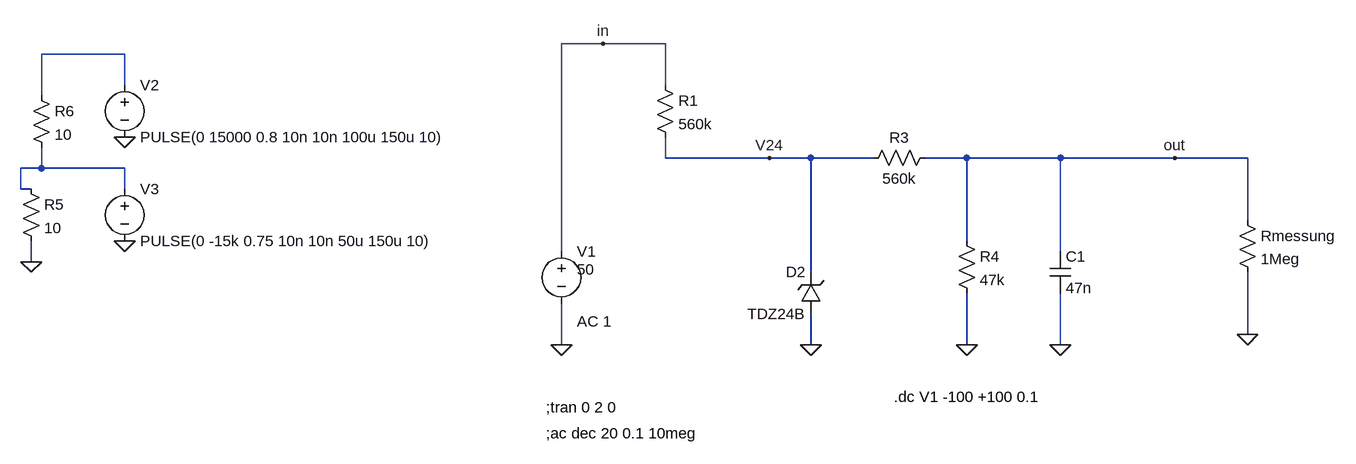
[diagram p0: schematic AnalogEingang.asc]
AnalogEingang.asc, the LTspice schematic file:
Version 4
SHEET 1 1468 680
WIRE -208 -160 -272 -160
WIRE -112 -160 -208 -160
WIRE -944 -144 -1072 -144
WIRE -944 -96 -944 -144
WIRE -112 -96 -112 -160
WIRE -1072 -80 -1072 -144
WIRE -112 16 -112 -16
WIRE 48 16 -112 16
WIRE 112 16 48 16
WIRE 208 16 112 16
WIRE 352 16 288 16
WIRE 496 16 352 16
WIRE 672 16 496 16
WIRE 784 16 672 16
WIRE -1072 32 -1072 0
WIRE -1072 32 -1104 32
WIRE -944 32 -1072 32
WIRE -1104 64 -1104 32
WIRE -1088 64 -1104 64
WIRE -944 64 -944 32
WIRE 784 112 784 16
WIRE 352 144 352 16
WIRE -272 160 -272 -160
WIRE 496 160 496 16
WIRE -1088 176 -1088 144
WIRE 112 192 112 16
WIRE 784 288 784 192
WIRE -272 304 -272 240
WIRE 112 304 112 256
WIRE 352 304 352 224
WIRE 496 304 496 224
FLAG 112 304 0
FLAG -272 304 0
FLAG 672 16 out
FLAG -208 -160 in
FLAG 784 288 0
FLAG 352 304 0
FLAG 496 304 0
FLAG -944 144 0
FLAG -944 -16 0
FLAG -1088 176 0
FLAG 48 16 V24
SYMBOL zener 128 256 R180
WINDOW 0 24 64 Left 2
WINDOW 3 24 0 Left 2
SYMATTR InstName D2
SYMATTR Value TDZ24B
SYMBOL voltage -272 144 R0
WINDOW 123 24 124 Left 2
WINDOW 39 0 0 Left 0
WINDOW 3 24 44 Left 2
SYMATTR Value2 AC 1
SYMATTR Value 50
SYMATTR InstName V1
SYMBOL res -128 -112 R0
SYMATTR InstName R1
SYMATTR Value 560k
SYMBOL res 768 96 R0
SYMATTR InstName Rmessung
SYMATTR Value 1Meg
SYMBOL res 304 0 R90
WINDOW 0 0 56 VBottom 2
WINDOW 3 32 56 VTop 2
SYMATTR InstName R3
SYMATTR Value 560k
SYMBOL res 336 128 R0
SYMATTR InstName R4
SYMATTR Value 47k
SYMBOL voltage -944 -112 R0
WINDOW 123 0 0 Left 0
WINDOW 39 0 0 Left 0
SYMATTR InstName V2
SYMATTR Value PULSE(0 15000 0.8 10n 10n 100u 150u 10)
SYMBOL cap 480 160 R0
SYMATTR InstName C1
SYMATTR Value 47n
SYMBOL voltage -944 48 R0
WINDOW 123 0 0 Left 0
WINDOW 39 0 0 Left 0
SYMATTR InstName V3
SYMATTR Value PULSE(0 -15k 0.75 10n 10n 50u 150u 10)
SYMBOL res -1104 48 R0
SYMATTR InstName R5
SYMATTR Value 10
SYMBOL res -1088 -96 R0
SYMATTR InstName R6
SYMATTR Value 10
TEXT 240 384 Left 2 !.dc V1 -100 +100 0.1
TEXT -296 400 Left 2 !;tran 0 2 0
TEXT -296 440 Left 2 !;ac dec 20 0.1 10meg

The netlist it stands for:
* AnalogEingang.asc
D2 0 V24 TDZ24B
V1 in 0 50 AC 1
R1 in V24 560k
Rmessung out 0 1Meg
R3 out V24 560k
R4 out 0 47k
V2 N001 0 PULSE(0 15000 0.8 10n 10n 100u 150u 10)
C1 out 0 47n
V3 N002 0 PULSE(0 -15k 0.75 10n 10n 50u 150u 10)
R5 N002 0 10
R6 N001 N002 10
.model D D
.lib standard.dio
.dc V1 -100 +100 0.1
;tran 0 2 0
;ac dec 20 0.1 10meg
.backanno
.end